# EAGLE design nfetdriver (EAGLE 6.5.0)
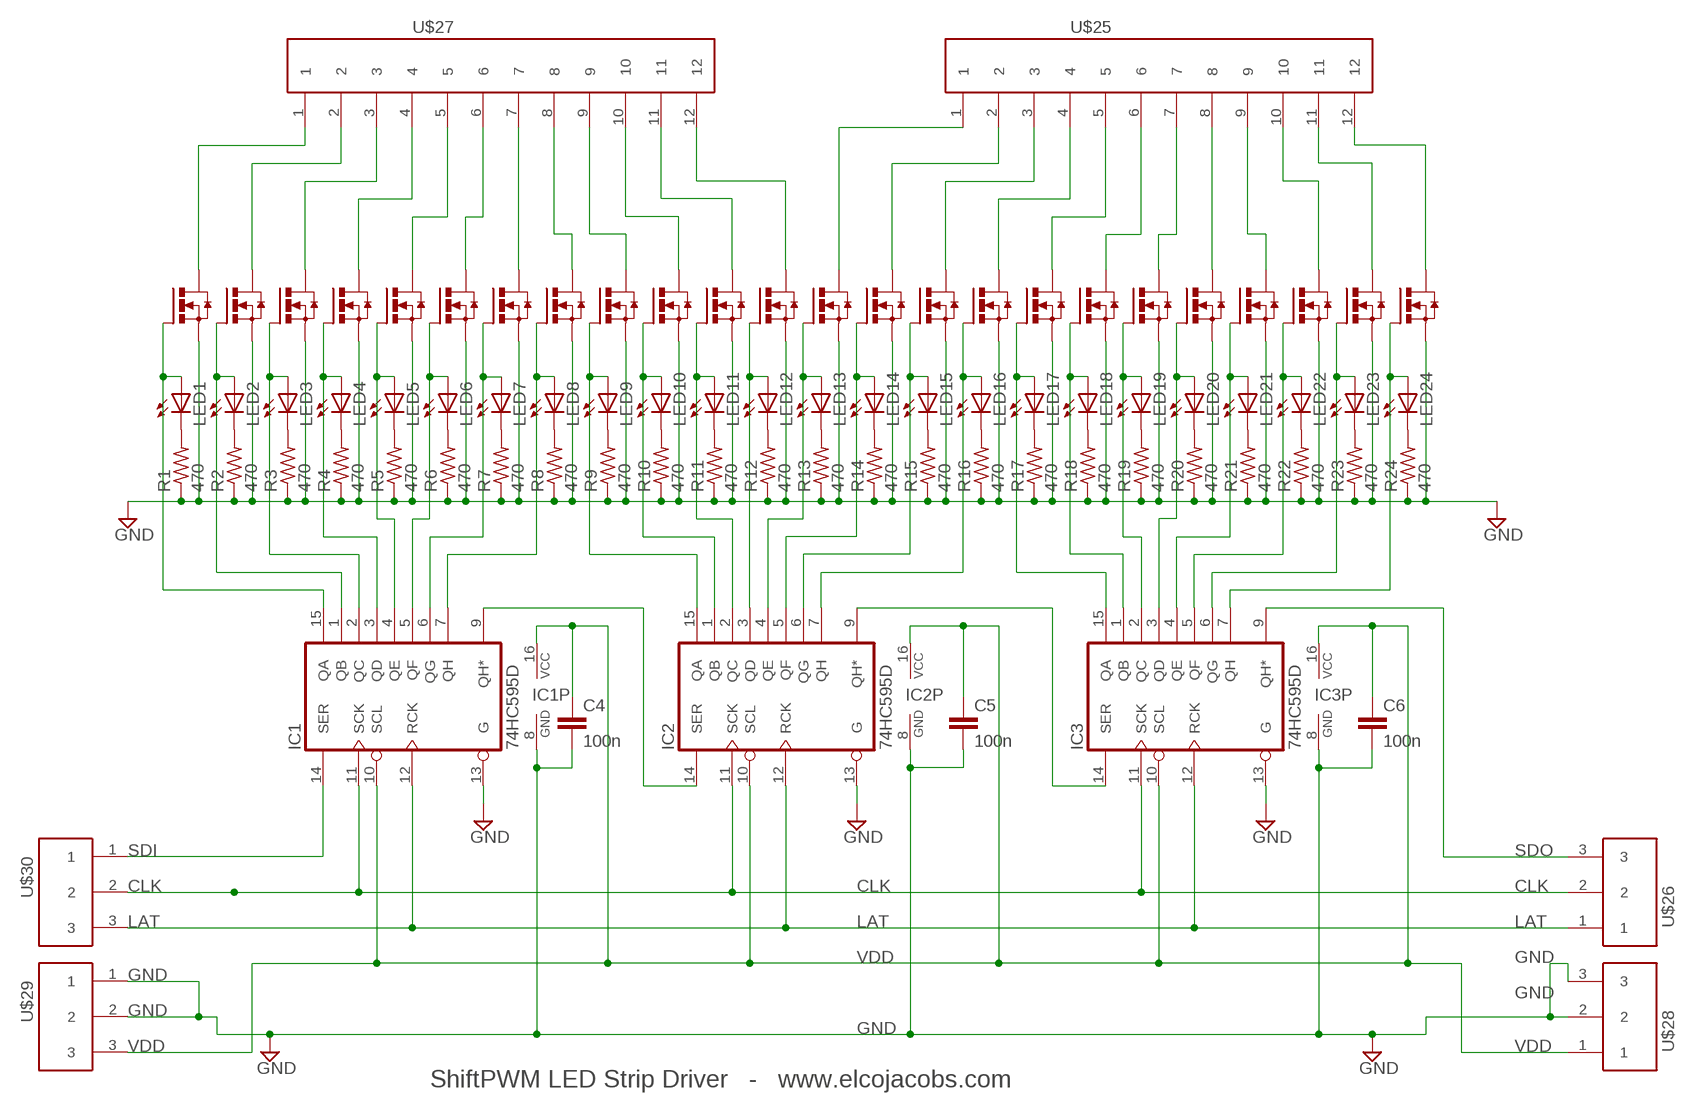
[diagram p0: schematic, sheet 1]

## Parts
C4  100n  C-EUC0603  [C0603]
C5  100n  C-EUC0603  [C0603]
C6  100n  C-EUC0603  [C0603]
IC1  74HC595D  [SO16]
IC2  74HC595D  [SO16]
IC3  74HC595D  [SO16]
LED1  LEDCHIPLED_0603  [CHIPLED_0603]
LED2  LEDCHIPLED_0603  [CHIPLED_0603]
LED3  LEDCHIPLED_0603  [CHIPLED_0603]
LED4  LEDCHIPLED_0603  [CHIPLED_0603]
LED5  LEDCHIPLED_0603  [CHIPLED_0603]
LED6  LEDCHIPLED_0603  [CHIPLED_0603]
LED7  LEDCHIPLED_0603  [CHIPLED_0603]
LED8  LEDCHIPLED_0603  [CHIPLED_0603]
LED9  LEDCHIPLED_0603  [CHIPLED_0603]
LED10  LEDCHIPLED_0603  [CHIPLED_0603]
LED11  LEDCHIPLED_0603  [CHIPLED_0603]
LED12  LEDCHIPLED_0603  [CHIPLED_0603]
LED13  LEDCHIPLED_0603  [CHIPLED_0603]
LED14  LEDCHIPLED_0603  [CHIPLED_0603]
LED15  LEDCHIPLED_0603  [CHIPLED_0603]
LED16  LEDCHIPLED_0603  [CHIPLED_0603]
LED17  LEDCHIPLED_0603  [CHIPLED_0603]
LED18  LEDCHIPLED_0603  [CHIPLED_0603]
LED19  LEDCHIPLED_0603  [CHIPLED_0603]
LED20  LEDCHIPLED_0603  [CHIPLED_0603]
LED21  LEDCHIPLED_0603  [CHIPLED_0603]
LED22  LEDCHIPLED_0603  [CHIPLED_0603]
LED23  LEDCHIPLED_0603  [CHIPLED_0603]
LED24  LEDCHIPLED_0603  [CHIPLED_0603]
R1  470  R-US_R0603  [R0603]
R2  470  R-US_R0603  [R0603]
R3  470  R-US_R0603  [R0603]
R4  470  R-US_R0603  [R0603]
R5  470  R-US_R0603  [R0603]
R6  470  R-US_R0603  [R0603]
R7  470  R-US_R0603  [R0603]
R8  470  R-US_R0603  [R0603]
R9  470  R-US_R0603  [R0603]
R10  470  R-US_R0603  [R0603]
R11  470  R-US_R0603  [R0603]
R12  470  R-US_R0603  [R0603]
R13  470  R-US_R0603  [R0603]
R14  470  R-US_R0603  [R0603]
R15  470  R-US_R0603  [R0603]
R16  470  R-US_R0603  [R0603]
R17  470  R-US_R0603  [R0603]
R18  470  R-US_R0603  [R0603]
R19  470  R-US_R0603  [R0603]
R20  470  R-US_R0603  [R0603]
R21  470  R-US_R0603  [R0603]
R22  470  R-US_R0603  [R0603]
R23  470  R-US_R0603  [R0603]
R24  470  R-US_R0603  [R0603]
U$1  SI2302DS  [SOT23]
U$2  SI2302DS  [SOT23]
U$3  SI2302DS  [SOT23]
U$4  SI2302DS  [SOT23]
U$5  SI2302DS  [SOT23]
U$6  SI2302DS  [SOT23]
U$7  SI2302DS  [SOT23]
U$8  SI2302DS  [SOT23]
U$9  SI2302DS  [SOT23]
U$10  SI2302DS  [SOT23]
U$11  SI2302DS  [SOT23]
U$12  SI2302DS  [SOT23]
U$13  SI2302DS  [SOT23]
U$14  SI2302DS  [SOT23]
U$15  SI2302DS  [SOT23]
U$16  SI2302DS  [SOT23]
U$17  SI2302DS  [SOT23]
U$18  SI2302DS  [SOT23]
U$19  SI2302DS  [SOT23]
U$20  SI2302DS  [SOT23]
U$21  SI2302DS  [SOT23]
U$22  SI2302DS  [SOT23]
U$23  SI2302DS  [SOT23]
U$24  SI2302DS  [SOT23]
U$25  3.5MM12P  [3.5MM12P]
U$26  3.5MM3PHORIZONTAL  [3.5MM3P]
U$27  3.5MM12P  [3.5MM12P]
U$28  3.5MM3PHORIZONTAL  [3.5MM3P]
U$29  3.5MM3PHORIZONTAL  [3.5MM3P]
U$30  3.5MM3PHORIZONTAL  [3.5MM3P]

## Nets
CLK: IC1.11(SCK) IC2.11(SCK) IC3.11(SCK) U$26.2 U$30.2
GND: C4.2 C5.2 C6.2 IC1.8(GND) IC1.13(G) IC2.8(GND) IC2.13(G) IC3.8(GND) IC3.13(G) R1.1 R2.1 R3.1 R4.1 R5.1 R6.1 R7.1 R8.1 R9.1 R10.1 R11.1 R12.1 R13.1 R14.1 R15.1 R16.1 R17.1 R18.1 R19.1 R20.1 R21.1 R22.1 R23.1 R24.1 U$1.SOURCE(S) U$2.SOURCE(S) U$3.SOURCE(S) U$4.SOURCE(S) U$5.SOURCE(S) U$6.SOURCE(S) U$7.SOURCE(S) U$8.SOURCE(S) U$9.SOURCE(S) U$10.SOURCE(S) U$11.SOURCE(S) U$12.SOURCE(S) U$13.SOURCE(S) U$14.SOURCE(S) U$15.SOURCE(S) U$16.SOURCE(S) U$17.SOURCE(S) U$18.SOURCE(S) U$19.SOURCE(S) U$20.SOURCE(S) U$21.SOURCE(S) U$22.SOURCE(S) U$23.SOURCE(S) U$24.SOURCE(S) U$28.2 U$28.3 U$29.1 U$29.2
LAT: IC1.12(RCK) IC2.12(RCK) IC3.12(RCK) U$26.1 U$30.3
N$1: IC1.9(QH*) IC2.14(SER)
N$2: IC2.9(QH*) IC3.14(SER)
N$3: IC1.15(QA) LED1.A U$1.GATE(G)
N$4: IC1.1(QB) LED2.A U$2.GATE(G)
N$5: IC1.2(QC) LED3.A U$3.GATE(G)
N$6: IC1.3(QD) LED4.A U$4.GATE(G)
N$7: IC1.4(QE) LED5.A U$5.GATE(G)
N$8: IC1.6(QG) LED7.A U$7.GATE(G)
N$10: IC1.5(QF) LED6.A U$6.GATE(G)
N$11: U$1.DRAIN(D) U$27.1
N$12: IC2.15(QA) LED9.A U$9.GATE(G)
N$13: IC2.1(QB) LED10.A U$10.GATE(G)
N$14: IC2.2(QC) LED11.A U$11.GATE(G)
N$15: IC2.3(QD) LED12.A U$12.GATE(G)
N$16: IC2.4(QE) LED13.A U$13.GATE(G)
N$17: IC2.5(QF) LED14.A U$14.GATE(G)
N$18: IC2.6(QG) LED15.A U$15.GATE(G)
N$19: IC2.7(QH) LED16.A U$16.GATE(G)
N$20: IC3.15(QA) LED17.A U$17.GATE(G)
N$21: IC3.1(QB) LED18.A U$18.GATE(G)
N$22: IC3.2(QC) LED19.A U$19.GATE(G)
N$23: IC3.3(QD) LED20.A U$20.GATE(G)
N$24: IC3.4(QE) LED21.A U$21.GATE(G)
N$25: IC3.5(QF) LED22.A U$22.GATE(G)
N$26: IC3.6(QG) LED23.A U$23.GATE(G)
N$27: IC3.7(QH) LED24.A U$24.GATE(G)
N$28: U$2.DRAIN(D) U$27.2
N$29: U$3.DRAIN(D) U$27.3
N$30: U$4.DRAIN(D) U$27.4
N$31: U$5.DRAIN(D) U$27.5
N$32: U$6.DRAIN(D) U$27.6
N$33: U$7.DRAIN(D) U$27.7
N$34: U$8.DRAIN(D) U$27.8
N$35: U$9.DRAIN(D) U$27.9
N$36: U$10.DRAIN(D) U$27.10
N$37: U$11.DRAIN(D) U$27.11
N$38: U$12.DRAIN(D) U$27.12
N$39: U$13.DRAIN(D) U$25.1
N$40: U$14.DRAIN(D) U$25.2
N$41: IC1.7(QH) LED8.A U$8.GATE(G)
N$42: U$16.DRAIN(D) U$25.4
N$43: U$17.DRAIN(D) U$25.5
N$44: U$18.DRAIN(D) U$25.6
N$45: U$19.DRAIN(D) U$25.7
N$46: U$20.DRAIN(D) U$25.8
N$47: U$21.DRAIN(D) U$25.9
N$48: U$22.DRAIN(D) U$25.10
N$49: U$23.DRAIN(D) U$25.11
N$50: U$24.DRAIN(D) U$25.12
N$75: LED1.C R1.2
N$76: LED2.C R2.2
N$77: LED3.C R3.2
N$78: LED4.C R4.2
N$79: LED5.C R5.2
N$80: LED6.C R6.2
N$81: LED7.C R7.2
N$82: LED8.C R8.2
N$83: LED9.C R9.2
N$84: LED10.C R10.2
N$85: LED11.C R11.2
N$86: LED12.C R12.2
N$87: LED13.C R13.2
N$88: LED14.C R14.2
N$89: LED15.C R15.2
N$90: LED16.C R16.2
N$91: LED17.C R17.2
N$92: LED18.C R18.2
N$93: LED19.C R19.2
N$94: LED20.C R20.2
N$95: LED21.C R21.2
N$96: LED22.C R22.2
N$97: LED23.C R23.2
N$98: LED24.C R24.2
N$99: U$15.DRAIN(D) U$25.3
SDI: IC1.14(SER) U$30.1
SDO: IC3.9(QH*) U$26.3
VDD: C4.1 C5.1 C6.1 IC1.10(SCL) IC1.16(VCC) IC2.10(SCL) IC2.16(VCC) IC3.10(SCL) IC3.16(VCC) U$28.1 U$29.3

## Notes on the sheet
- SDI | SDO
- VDD
- ShiftPWM LED Strip Driver   -   www.elcojacobs.com

## Library data of the parts
C4-C6 = resistor:C-EU: CAPACITOR, European symbol
IC1-IC3 = 74xx-eu:74*595: 8-bit SHIFT REGISTER, output latch
LED1-LED24 = adafruit:LED: LED OSRAM: - CHIPLED LG R971, LG N971, LY N971, LG Q971, LY Q971, LO R971, LY R971 LH N974, LH R974 LS Q976, LO Q976, LY Q976 LO Q996 - Hyper CHIPLED LW Q18S LB Q993, LB Q99A, LB R99A - SideLED LS A670, LO A670, LY A670, LG A670, LP A670 LB A673, LV A673, LT A673, LW A673 LH A674 LY A675 LS A676, LA A676, LO A676, LY A676, LW A676 LS A679, LY A679, LG A679 - Hyper Micro SIDELED® LS Y876, LA Y876, LO Y876, LY Y876 LT Y87S - SmartLED LW L88C, LW L88S LB L89C, LB L89S, LG L890 LS L89K, LO L89K, LY L89K LS L896, LA L896, LO L896, LY L896 - TOPLED LS T670, LO T670, LY T670, LG T670, LP T670 LSG T670, LSP T670, LSY T670, LOP T670, LYG T670 LG T671, LOG T671, LSG T671 LB T673, LV T673, LT T673, LW T673 LH T674 LS T676, LA T676, LO T676, LY T676, LB T676, LH T676, LSB T676, LW T676 LB T67C, LV T67C, LT T67C, LS T67K, LO T67K, LY T67K, LW E67C LS E67B, LA E67B, LO E67B, LY E67B, LB E67C, LV E67C, LT E67C LW T67C LS T679, LY T679, LG T679 LS T770, LO T770, LY T770, LG T770, LP T770 LB T773, LV T773, LT T773, LW T773 LH T774 LS E675, LA E675, LY E675, LS T675 LS T776, LA T776, LO T776, LY T776, LB T776 LHGB T686 LT T68C, LB T68C - Hyper Mini TOPLED® LB M676 - Mini TOPLED Santana® LG M470 LS M47K, LO M47K, LY M47K Source: http://www.osram.convergy.de/
R1-R24 = adafruit:R-US_: RESISTOR, American symbol
U$1-U$24 = transistor-power:SI2302DS
U$25 U$27 = elcojacobs:3.5MM12P
U$26 U$28-U$30 = elcojacobs:3.5MM3P

## Board
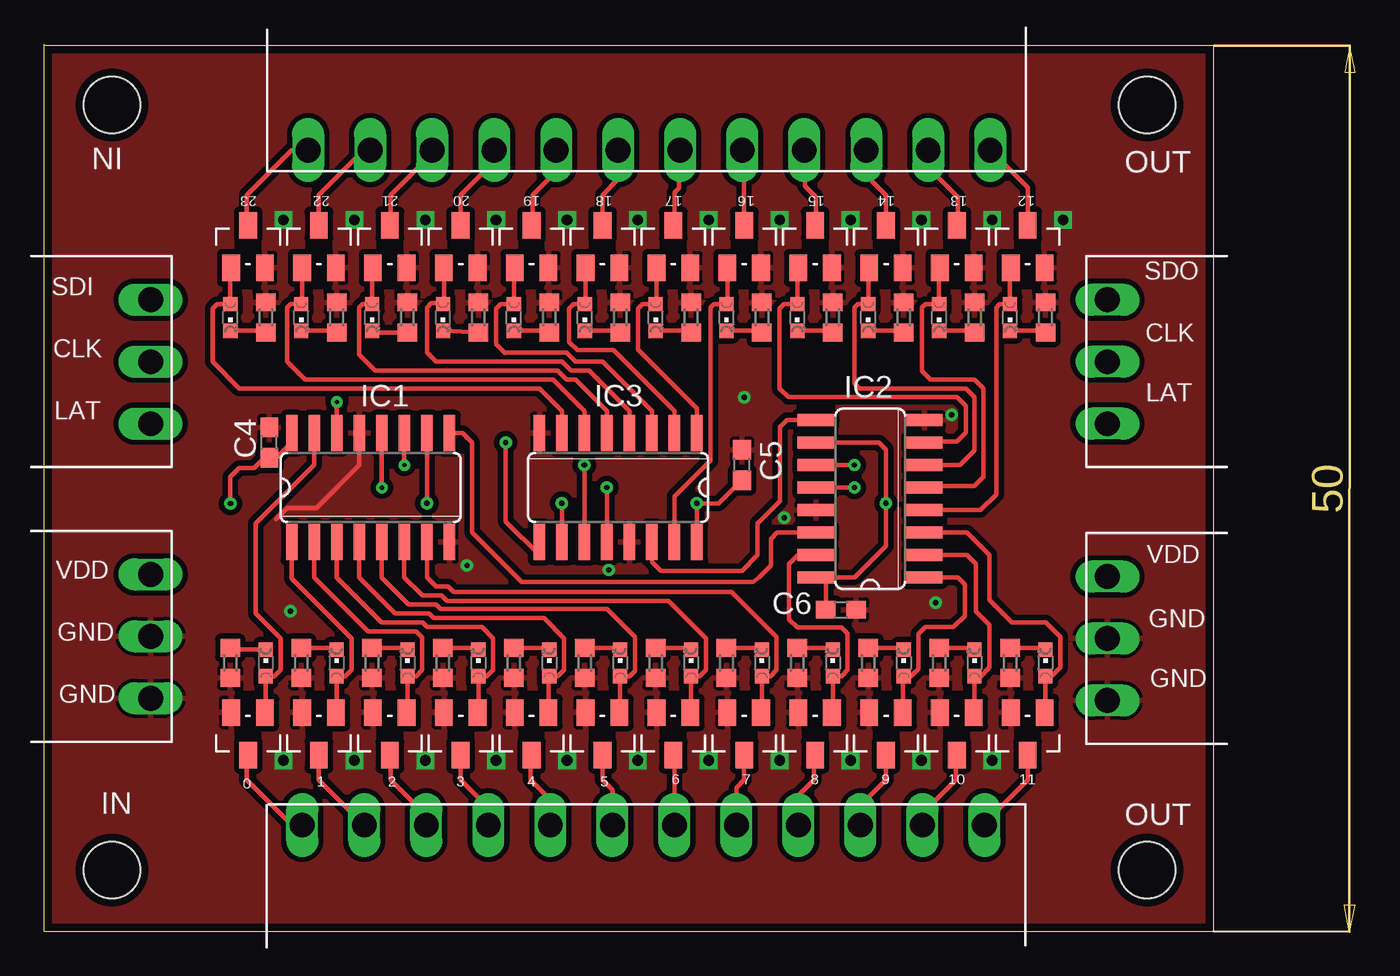
[diagram p1: board, top side]
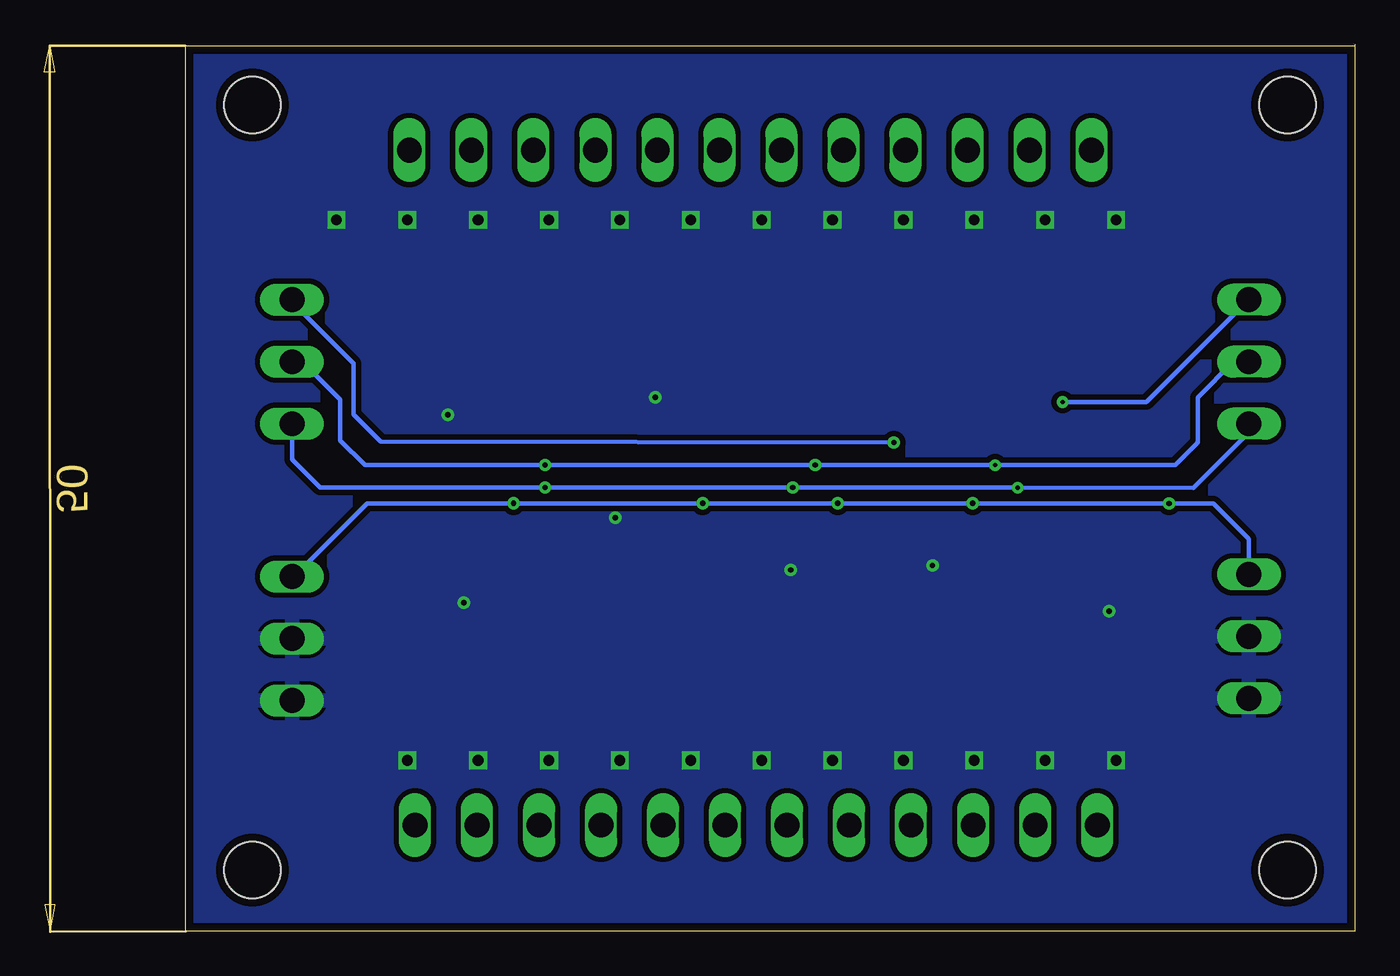
[diagram p2: board, bottom side, seen from below]

Size 66 x 50.08 mm. Coordinates in mm from the lower left corner, seen from the top.
Outline: 0,50 66,50 66,0 0,0 0,50
Outline: 0,50 0,50.08
Copper layers (1*16): Top 0.018mm / dielectric 1.55mm / Bottom 0.018mm
Design rules "default": minimum track width 0.15mm, minimum drill 0.25mm, track to track 0.15mm, track to pad 0.15mm, pad to pad 0.15mm, via to via 0.15mm, smd to smd 0.15mm, copper to edge 0.45mm, drill to drill 0.3mm, minimum pad ring 0.2mm, minimum via ring 0.2mm, stop-mask expansion 0.1mm, vias tented up to drill 25mil, thermal gap 0.2mm
Holes 3.2 mm at 3.81,3.47 3.81,46.65 62.23,46.65 62.23,3.47

### Footprints (pad centres in the part's own frame; a part is rotated, then mirrored left to right if it is on the bottom)
C0603 = smd 1.1 x 1: 1 -0.85,0; 2 0.85,0
SO16 = smd 0.66 x 2.032: 1 -4.445,-3.073; 2 -3.175,-3.073; 3 -1.905,-3.073; 4 -0.635,-3.073; 5 0.635,-3.073; 6 1.905,-3.073; 7 3.175,-3.073; 8 4.445,-3.073; 9 4.445,3.073; 10 3.175,3.073; 11 1.905,3.073; 12 0.635,3.073; 13 -0.635,3.073; 14 -1.905,3.073; 15 -3.175,3.073; 16 -4.445,3.073
CHIPLED_0603 = smd 0.8 x 0.8: A 0,-0.75; C 0,0.75
R0603 = smd 1 x 1.1: 1 -0.85,0; 2 0.85,0
SOT23 = smd 1 x 1.5: DRAIN 0,1.2; GATE -0.95,-1.2; SOURCE 0.95,-1.2
3.5MM12P = drill 1.4 long: 1 -21,0; 2 -17.5,0; 3 -14,0; 4 -10.5,0; 5 -7,0; 6 -3.5,0; 7 0,0; 8 3.5,0; 9 7,0; 10 10.5,0; 11 14,0; 12 17.5,0
3.5MM3P = drill 1.4 long: 1 -3.5,0; 2 0,0; 3 3.5,0

### Placement (x,y rotation side)
C4  12.7,27.6 90 top
C5  39.37,26.33 90 top
C6  44.96,18.16 0 top
IC1  18.41,25.06 0 top
IC2  46.61,24.43 90 top
IC3  32.38,25.06 180 top
LED1  12.5,15.16 0 top
LED2  16.5,15.16 0 top
LED3  20.5,15.16 0 top
LED4  24.5,15.16 0 top
LED5  28.5,15.16 0 top
LED6  32.5,15.16 0 top
LED7  36.5,15.16 0 top
LED8  40.5,15.16 0 top
LED9  44.5,15.16 0 top
LED10  48.5,15.16 0 top
LED11  52.5,15.16 0 top
LED12  56.5,15.16 0 top
LED13  54.5,34.66 180 top
LED14  50.5,34.66 180 top
LED15  46.5,34.66 180 top
LED16  42.5,34.66 180 top
LED17  38.5,34.66 180 top
LED18  34.5,34.66 180 top
LED19  30.5,34.66 180 top
LED20  26.5,34.66 180 top
LED21  22.5,34.66 180 top
LED22  18.5,34.66 180 top
LED23  14.5,34.66 180 top
LED24  10.5,34.66 180 top
R1  10.5,15.16 90 top
R2  14.5,15.16 90 top
R3  18.5,15.16 90 top
R4  22.5,15.16 90 top
R5  26.5,15.16 90 top
R6  30.5,15.16 90 top
R7  34.5,15.16 90 top
R8  38.5,15.16 90 top
R9  42.5,15.16 90 top
R10  46.5,15.16 90 top
R11  50.5,15.16 90 top
R12  54.5,15.16 90 top
R13  56.5,34.66 270 top
R14  52.5,34.66 270 top
R15  48.5,34.66 270 top
R16  44.5,34.66 270 top
R17  40.5,34.66 270 top
R18  36.5,34.66 270 top
R19  32.5,34.66 270 top
R20  28.5,34.66 270 top
R21  24.5,34.66 270 top
R22  20.5,34.66 270 top
R23  16.5,34.66 270 top
R24  12.5,34.66 270 top
U$1  11.5,11.16 180 top
U$2  15.5,11.16 180 top
U$3  19.5,11.16 180 top
U$4  23.5,11.16 180 top
U$5  27.5,11.16 180 top
U$6  31.5,11.16 180 top
U$7  35.5,11.16 180 top
U$8  39.5,11.16 180 top
U$9  43.5,11.16 180 top
U$10  47.5,11.16 180 top
U$11  51.5,11.16 180 top
U$12  55.5,11.16 180 top
U$13  55.5,38.66 0 top
U$14  51.5,38.66 0 top
U$15  47.5,38.66 0 top
U$16  43.5,38.66 0 top
U$17  39.5,38.66 0 top
U$18  35.5,38.66 0 top
U$19  31.5,38.66 0 top
U$20  27.5,38.66 0 top
U$21  23.5,38.66 0 top
U$22  19.5,38.66 0 top
U$23  15.5,38.66 0 top
U$24  11.5,38.66 0 top
U$25  32.38,44.11 180 top
U$26  60,32.16 90 top
U$27  35.56,6.01 0 top
U$28  6,16.66 270 top
U$29  60,16.54 90 top
U$30  6,32.16 270 top

### Tracks (layer width: path | path; a pad name or v marks a point on that pad's centre or on a via)
CLK  (via drill 0.25 pad 0.25, 0.3 pad 0.25)
  Top 0.254: 43.83,26.16 IC2.11 v45.72,26.33 | IC1.11 v20.32,26.33 | v30.48,26.33 IC3.11
  Bottom 0.254: U$30.2 6.87,32.16 8.89,30.14 8.89,27.6 10.16,26.33 v20.32,26.33 v30.48,26.33 v45.72,26.33 55.88,26.33 57.28,27.73 57.28,30.01 59.42,32.16 U$26.2
GND  (via drill 0.3 pad 0.25, 0.3 pad 0.3, 0.6)
  Top 0.254: 13.08,23.28 13.72,23.92 15.37,23.92 17.78,26.33 IC1.13
  other vias: 45.5,9.66 13.5,9.66 17.5,9.66 21.5,9.66 25.5,9.66 41.5,40.16 37.5,40.16 33.5,40.16 29.5,40.16 25.5,40.16 21.5,40.16 17.5,40.16 13.5,40.16 45.5,40.16 49.5,40.16 53.5,40.16 57.5,40.16 29.5,9.66 33.5,9.66 37.5,9.66 41.5,9.66 49.5,9.66 53.5,9.66 41.75,23.36 51.2,29.16 50.3,18.56 23.86,20.66 13.88,18.07 39.5,30.16 31.86,20.41
  pour Bottom (isolate 0.305): 0,50.21 0,-0.34 66.01,-0.84 66.01,49.96
  pour Top (isolate 0.305): -0.15,50.1 -0.38,-0.47 66.01,-0.84 66.01,49.96
LAT  (via drill 0.25 pad 0.25, 0.3 pad 0.25)
  Top 0.254: 43.69,25.16 IC2.12 v45.72,25.06 | IC1.12 v19.05,25.06 | v31.75,25.06 IC3.12
  Bottom 0.254: U$30.3 6,28.16 9.13,25.03 v19.05,25.06 v31.75,25.06 v45.72,25.06 58.42,25.06 60,26.64 U$26.1
N$1
  Top 0.254: 43.81,22.52 IC2.14 41.36,22.52 41,22.16 41,20.66 40.32,19.98 40.01,19.73 26.92,19.73 24.13,22.52 24.13,27.6 23.6,28.13 IC1.9
N$2
  Top 0.254: 44.45,28.87 IC2.9 41.91,28.87 41.53,28.49 41.53,24.3 40.26,23.03 40.26,21.25 39.37,20.36 34.8,20.36 34.29,20.87 IC3.14
N$3
  Top 0.254: U$1.GATE 12.5,12.41 LED1.A 12.97,14.41 13.34,14.77 13.34,16.55 11.94,17.95 11.94,23.03 15.24,26.33 IC1.15
N$4
  Top 0.254: U$2.GATE 16.5,12.41 LED2.A 16.97,14.41 17.34,14.77 17.34,16.55 13.97,19.92 IC1.1
N$5
  Top 0.254: U$3.GATE 20.5,12.41 LED3.A 20.97,14.41 21.34,14.77 21.34,16.59 20.99,16.93 18.29,16.93 15.24,19.98 IC1.2
N$6
  Top 0.254: U$4.GATE 24.5,12.41 LED4.A 24.97,14.41 25.34,14.77 25.34,16.55 24.7,17.19 21.59,17.19 21.34,17.44 19.05,17.44 16.51,19.98 IC1.3
N$7
  Top 0.254: U$5.GATE 28.45,14.36 | 28.45,14.36 LED5.A 28.97,14.41 29.34,14.77 29.34,16.55 28.19,17.69 21.97,17.69 21.72,17.95 19.81,17.95 17.78,19.98 IC1.4 | 28.45,14.36 28.67,14.36
N$8
  Top 0.254: U$7.GATE 36.5,12.41 LED7.A 36.98,14.41 37.34,14.77 37.34,16.55 35.23,18.66 22.74,18.66 22.43,18.96 21.34,18.96 20.32,19.98 IC1.6
N$10
  Top 0.254: U$6.GATE 32.5,12.41 LED6.A 33.04,14.41 33.34,14.71 33.34,16.62 31.75,18.2 22.35,18.2 22.1,18.46 20.57,18.46 19.05,19.98 IC1.5
N$11
  Top 0.254: U$27.1 13.97,6.01 11.43,8.55 11.43,9.89 U$1.DRAIN
N$12
  Top 0.254: U$9.GATE 44.5,12.41 LED9.A 44.98,14.41 45.34,14.77 45.34,16.82 45,17.16 42.5,17.16 42.04,17.62 42.04,20.74 42.55,21.25 IC2.15
N$13
  Top 0.254: U$10.GATE 48.45,14.36 LED10.A 48.75,14.41 48.91,14.41 49.34,14.83 49.34,16.8 49.72,17.19 51.31,17.19 51.94,17.82 51.94,19.6 51.56,19.98 IC2.1 50.8,19.98
N$14
  Top 0.254: U$11.GATE 52.5,12.41 LED11.A 52.84,14.41 53.34,14.9 53.34,17.31 52.58,18.07 52.58,20.74 52.07,21.25 IC2.2
N$15
  Top 0.254: U$12.GATE 56.5,12.41 LED12.A 56.84,14.41 57.34,14.9 57.34,16.62 56.52,17.44 54.61,17.44 53.34,18.71 53.34,21.25 52.07,22.52 IC2.3
N$16
  Top 0.254: U$13.GATE 54.5,37.41 LED13.A 53.91,35.41 53.72,35.22 53.72,24.68 52.83,23.79 IC2.4
N$17
  Top 0.254: U$14.GATE 50.5,37.41 LED14.A 49.72,35.41 49.53,35.22 49.53,31.63 50,31.16 52.5,31.16 53,30.66 53,25.66 52.5,25.16 49.71,25.16 IC2.5
N$18
  Top 0.254: U$15.GATE 46.5,37.41 LED15.A 45.91,35.41 45.72,35.22 45.72,30.94 46,30.66 52,30.66 52.5,30.16 52.5,27.16 51.67,26.33 IC2.6
N$19
  Top 0.254: U$16.GATE 42.5,37.41 LED16.A 41.75,35.41 41.5,35.16 41.5,30.66 42,30.16 51.5,30.16 52,29.66 52,28.16 51.5,27.66 49.75,27.66 IC2.7
N$20
  Top 0.254: U$17.GATE 38.55,35.46 LED17.A 37.78,35.41 37.59,35.22 37.59,26.58 35.56,24.55 IC3.15
N$21
  Top 0.254: U$18.GATE 34.55,35.46 LED18.A 33.75,35.41 33.5,35.16 33.5,32.83 36.83,29.5 IC3.1
N$22
  Top 0.254: U$19.GATE 30.55,35.46 LED19.A 29.88,35.41 29.63,35.16 29.63,33.28 30.1,32.81 32.13,32.81 35.56,29.38 IC3.2
N$23
  Top 0.254: U$20.GATE 26.5,37.41 LED20.A 25.75,35.41 25.5,35.16 25.5,33.16 26,32.66 26.02,32.68 29.46,32.68 29.97,32.17 31.5,32.17 34.29,29.38 IC3.3
N$24
  Top 0.254: 22.25,35.16 LED21.A 22.55,35.46 | U$21.GATE 22.55,35.46 | 22.55,35.46 21.83,35.46 21.59,35.22 21.59,32.68 22.1,32.17 29.21,32.17 29.72,31.66 30.73,31.66 33.02,29.38 IC3.4
N$25
  Top 0.254: U$22.GATE 18.5,37.41 LED22.A 17.97,35.41 17.78,35.22 17.78,32.55 18.67,31.66 28.96,31.66 29.46,31.16 29.97,31.16 31.75,29.38 IC3.5
N$26
  Top 0.254: U$23.GATE 14.55,35.46 LED23.A 13.91,35.41 13.72,35.22 13.72,32.17 14.73,31.16 28.7,31.16 30.48,29.38 IC3.6
N$27
  Top 0.254: LED24.A 10.5,37.41 U$24.GATE | 29.21,27.6 IC3.7 29.21,29.38 27.94,30.65 25.53,30.65 11,30.66 9.5,32.16 9.5,35.16 9.75,35.41 LED24.A | 10.16,35.45 LED24.A
N$28
  Top 0.254: U$27.2 18.03,6.01 15.49,8.55 U$2.DRAIN
N$29
  Top 0.254: U$27.3 21.56,6.55 19.56,8.55 19.56,9.9 U$3.DRAIN
N$30
  Top 0.254: U$27.4 25.06,6.99 23.5,8.55 U$4.DRAIN
N$31
  Top 0.254: U$27.5 28.56,7.42 27.43,8.55 27.43,9.89 U$5.DRAIN
N$32
  Top 0.254: 31.45,9.91 U$6.DRAIN 31.5,8.55 32.06,7.99 U$27.6
N$33
  Top 0.254: U$27.7 35.56,9.9 U$7.DRAIN
N$34
  Top 0.254: U$27.8 39.06,8.11 39.5,8.55 U$8.DRAIN
N$35
  Top 0.254: U$27.9 42.56,7.68 43.43,8.55 43.43,9.89 U$9.DRAIN
N$36
  Top 0.254: U$27.10 46.06,7.11 47.5,8.55 U$10.DRAIN
N$37
  Top 0.254: 51.5,9.66 U$11.DRAIN 51.44,9.89 51.44,8.55 49.56,6.67 U$27.11
N$38
  Top 0.254: U$27.12 53.06,6.11 55.5,8.55 U$12.DRAIN
N$39
  Top 0.254: U$13.DRAIN 55.5,42 U$25.1
N$40
  Top 0.254: U$14.DRAIN 51.56,39.92 51.56,41.44 49.91,43.09 49.91,44.08 U$25.2
N$41
  Top 0.254: U$8.GATE 40.5,12.41 LED8.A 40.97,14.41 41.34,14.77 41.34,16.62 38.79,19.16 23.11,19.16 22.8,19.47 22.1,19.47 21.59,19.98 IC1.7
N$42
  Top 0.254: U$16.DRAIN 43.56,39.92 43.56,41.44 42.93,42.08 42.93,44.07 U$25.4
N$43
  Top 0.254: U$17.DRAIN 39.5,44 U$25.5
N$44
  Top 0.254: U$18.DRAIN 35.56,39.92 35.56,41.7 35.81,41.95 35.81,44.04 U$25.6
N$45
  Top 0.254: U$19.DRAIN 31.5,41.57 32.38,42.46 U$25.7
N$46
  Top 0.254: U$20.DRAIN 27.56,39.92 27.56,41.57 28.83,42.84 28.83,44.05 U$25.8
N$47
  Top 0.254: U$25.9 25.39,43.46 23.5,41.57 U$21.DRAIN
N$48
  Top 0.254: U$22.DRAIN 19.56,39.92 19.56,41.57 21.89,43.9 U$25.10
N$49
  Top 0.254: U$23.DRAIN 15.49,41.57 18.03,44.11 U$25.11
N$50
  Top 0.254: U$24.DRAIN 11.43,39.93 11.43,41.57 13.97,44.11 U$25.12
N$75
  Top 0.254: LED1.C 10.6,15.91 R1.2
N$76
  Top 0.254: R2.2 16.4,16.01 LED2.C
N$77
  Top 0.254: 20.46,16 LED3.C 20.5,16.01 R3.2
N$78
  Top 0.254: R4.2 24.4,16.01 LED4.C
N$79
  Top 0.254: R5.2 28.4,16.01 LED5.C
N$80
  Top 0.254: R6.2 32.4,16.01 LED6.C
N$81
  Top 0.254: R7.2 36.4,16.01 LED7.C
N$82
  Top 0.254: R8.2 40.4,16.01 LED8.C
N$83
  Top 0.254: R9.2 44.4,16.01 LED9.C
N$84
  Top 0.254: R10.2 48.4,16.01 LED10.C
N$85
  Top 0.254: R11.2 52.4,16.01 LED11.C
N$86
  Top 0.254: R12.2 56.4,16.01 LED12.C
N$87
  Top 0.254: LED13.C 56.4,33.91 R13.2
N$88
  Top 0.254: LED14.C 52.4,33.91 R14.2
N$89
  Top 0.254: LED15.C 48.4,33.91 R15.2
N$90
  Top 0.254: LED16.C 44.4,33.91 R16.2
N$91
  Top 0.254: LED17.C 40.4,33.91 R17.2
N$92
  Top 0.254: LED18.C 36.4,33.91 R18.2
N$93
  Top 0.254: LED19.C 32.4,33.91 R19.2
N$94
  Top 0.254: LED20.C 28.4,33.91 R20.2
N$95
  Top 0.254: R21.2 24.6,33.81 LED21.C
N$96
  Top 0.254: R22.2 18.6,33.81 LED22.C
N$97
  Top 0.254: LED23.C 16.4,33.91 R23.2
N$98
  Top 0.254: LED24.C 12.4,33.91 R24.2
N$99
  Top 0.254: U$15.DRAIN 47.5,41.57 46.35,42.71 46.35,44.08 U$25.3
SDI  (via drill 0.25 pad 0.25)
  Top 0.254: IC1.14 v16.51,29.89
  Bottom 0.254: U$30.1 11.77,29.89 v16.51,29.89
SDO  (via drill 0.3 pad 0.25)
  Top 0.254: v26.04,27.6 26.04,23.16 27.94,21.25 IC3.9
  Bottom 0.254: v26.04,27.6 55,27.66 56.52,29.18 56.52,32.04 60,35.53 U$26.3
VDD  (via drill 0.3 pad 0.25)
  Top 0.254: 43.53,27.66 IC2.10 47.12,27.6 47.5,27.22 v47.5,24.17 47.5,21.76 45.72,19.98 44.45,19.98 | 43.77,20.16 IC2.16 44.45,19.98 | v10.5,24.16 10.5,25.66 11,26.16 11.85,26.16 12.44,26.75 C4.1 13.12,26.75 13.97,27.6 IC1.16 14.13,28.66 14,28.66 | IC1.10 v21.59,24.17 | v29.21,24.17 IC3.10 | IC3.16 v36.83,24.17 38.06,24.17 C5.1 | C6.1 44.11,19.64 44.45,19.98
  Bottom 0.254: U$28.1 6,22.16 8,24.16 v10.5,24.16 v21.59,24.17 v29.21,24.17 v36.83,24.17 v47.5,24.17 55.75,24.17 59.88,20.04 U$29.3

### Text on the board
tNames: IN | OUT | 23 | 22 | 21 | 20 | 19 | 18 | 17 | 16 | 15 | 14 | 13 | 12 | SDO | SDI | CLK | CLK | LAT | LAT | VDD | VDD | GND | GND | GND | GND | 1 | 2 | 3 | 4 | 5 | 6 | 7 | 8 | 9 | 10 | 11 | 0 | IN | OUT